# Altium schematic sheet BatteryCharger.SchDoc: WearTech_PMU_Part2
size A4; DrawnBy: WearTech; Revision: 1; SheetNumber: 2; SheetTotal: 4
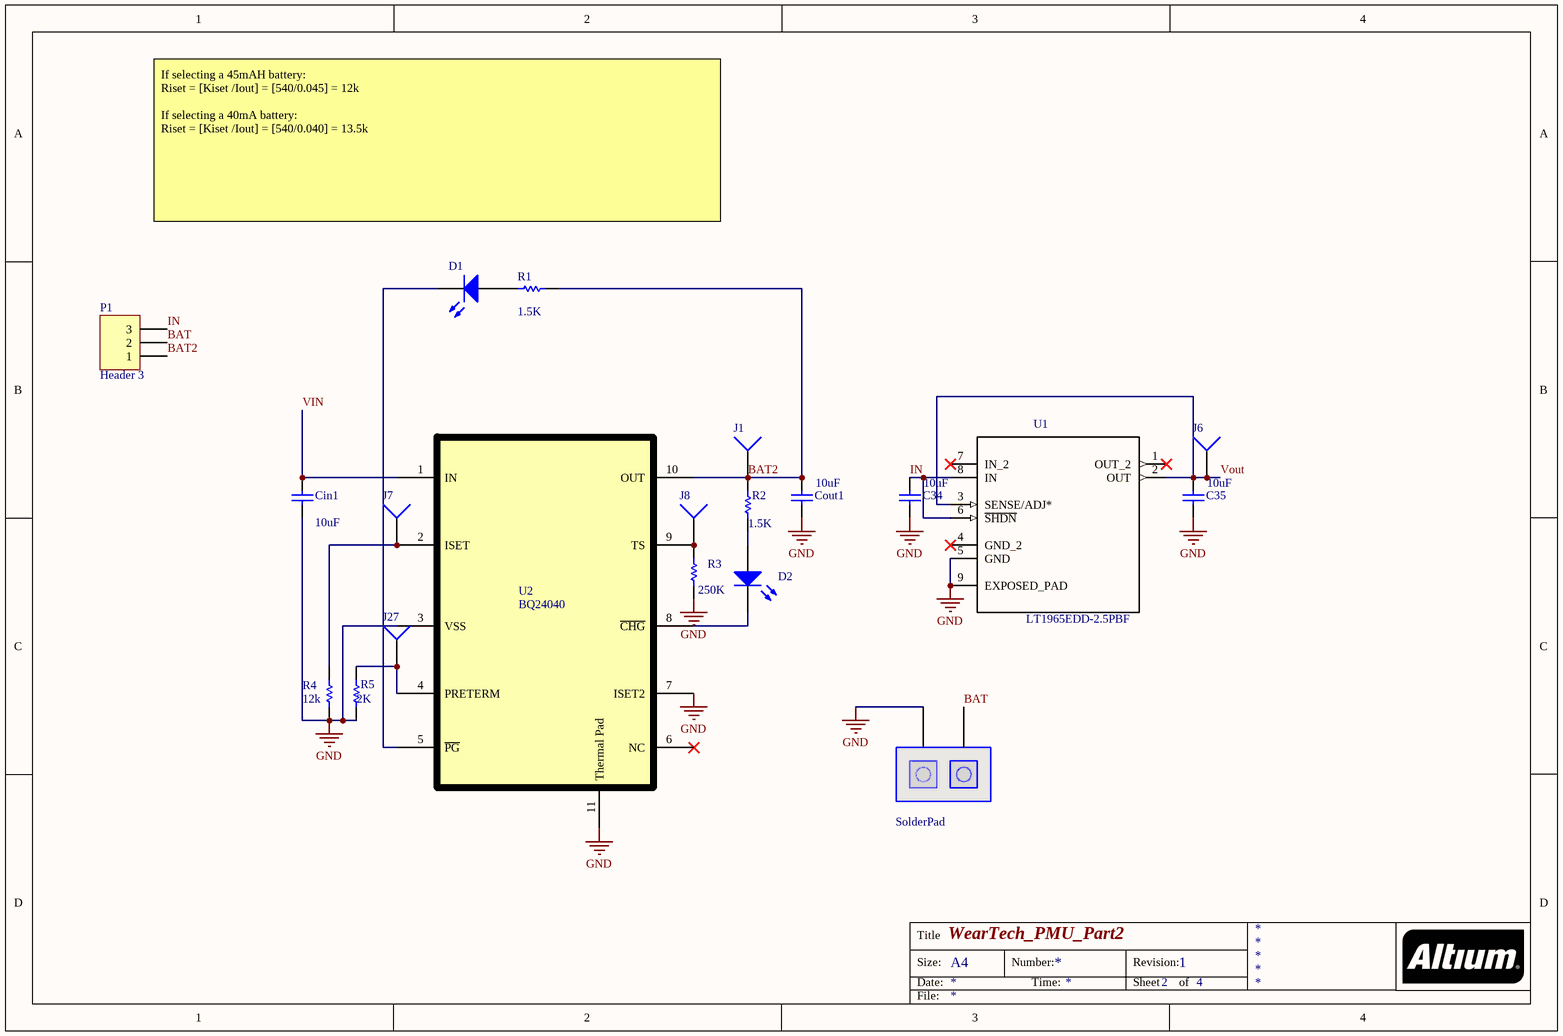
[diagram p0: BatteryCharger.SchDoc]

## Parts
1  SolderPad  [bATTERY_CONNECTION]
C34  value 10uF  [1608[0603]]  (hidden comment: Cap)
C35  value 10uF  [1608[0603]]  (hidden comment: Cap)
Cin1  value 10uF  [1608[0603]]  (hidden comment: Cap)
Cout1  value 10uF  [1608[0603]]  (hidden comment: Cap)
D1  LED0  [1608[0603]]  (value not drawn)
D2  LED0  [1608[0603]]  (value not drawn)
J1  Socket  [PIN1]  (value not drawn)
J6  Socket  [PIN1]  (value not drawn)
J7  Socket  [PIN1]  (value not drawn)
J8  Socket  [PIN1]  (value not drawn)
J27  Socket  [PIN1]  (value not drawn)
P1  Header 3  [HDR1X3]
R1  value 1.5K  [1608[0603]]  (hidden comment: Res1)
R2  value 1.5K  [1608[0603]]  (hidden comment: Res1)
R3  value 250K  [1608[0603]]  (hidden comment: Res1)
R4  value 12k  [1608[0603]]  (hidden comment: Res1)
R5  value 2K  [1608[0603]]  (hidden comment: Res1)
U1  LT1965EDD-2.5PBF  [LT1965]
U2  BQ24040  [BQ24040]

## Nets
GND: 1.2(GND) C34.2 C35.2 Cin1.2 Cout1.2 R3.1 R4.2 R5.2 U1.5(GND) U1.9(EXPOSED_PAD) U2.3(VSS) U2.7(ISET2) U2.11(Thermal_Pad)
BAT: 1.1(BAT) P1.2
BAT2: Cout1.1 J1.1 P1.1 R1.2 R2.1 U2.10(OUT)
IN: C34.1 P1.3 U1.6(~{SHDN}) U1.8(IN)
VIN: Cin1.1 U2.1(IN)
Vout: C35.1 J6.1 U1.2(OUT) U1.3(SENSE/ADJ*)
NetD1_1: D1.1(A) R1.1
NetD1_2: D1.2(K) U2.5(~{PG})
NetD2_1: D2.1(A) R2.2
NetD2_2: D2.2(K) U2.8(~{CHG})
NetJ7_1: J7.1 R4.1 U2.2(ISET)
NetJ8_1: J8.1 R3.2 U2.9(TS)
NetJ27_1: J27.1 R5.1 U2.4(PRETERM)

Not connected (* = marked no-connect by the designer): U1 1(OUT_2)* 4(GND_2)* 7(IN_2)*; U2 6(NC)*

## Notes on the sheet
- If selecting a 45mAH battery:
  Riset = [Kiset /Iout] = [540/0.045] = 12k
  If selecting a 40mA battery:
  Riset = [Kiset /Iout] = [540/0.040] = 13.5k
- Title
- Size:
- Date:
- A4
- Number:
- Time:
- Revision:
- Sheet
- of
- File:

## Library data of the parts
1 = SolderPad: Manufacturer: b; Link: Link; Description: Description; Manufacture Part Num: Manufacture Part Num; DigiKey Part Number: D; ComponentLink1URL: Datasheet; ComponentLink1Description: c
C34 Cout1 = Cap: Capacitor; Manufacture Part Num: 06034D106MAT2A; Manufacturer: AVX Corporation; Description: CAP CER 10UF 4V X5R 0603; Link: https://www.digikey.com/product-detail/en/avx-corporation/06034D106MAT2A/478-5718-1-ND/2136326; DigiKey Part Number: 478-5718-1-ND; ComponentLink1URL: Datasheet; ComponentLink1Description: http://datasheets.avx.com/cx5r.pdf
C35 = Cap: Capacitor; Manufacture Part Num: 06034D106MAT2A; Manufacturer: Murata Electronics North America; Description: CAP CER 10UF 4V X5R 0603; Link: https://www.digikey.com/product-detail/en/avx-corporation/06034D106MAT2A/478-5718-1-ND/2136326; DigiKey Part Number: 490-8278-1-ND; ComponentLink1URL: Datasheet; ComponentLink1Description: http://search.murata.co.jp/Ceramy/image/img/A01X/partnumbering_e_01.pdf
Cin1 = Cap: Capacitor; Manufacture Part Num: GRM188R60J106ME47D; Manufacturer: Murata Electronics North America; Description: CAP CER 10UF 6.3V X5R 0603; Link: https://www.digikey.com/product-detail/en/murata-electronics-north-america/GRM188R60J106ME47D/490-3896-1-ND/965938; DigiKey Part Number: 490-3896-1-ND; ComponentLink1URL: Datasheet; ComponentLink1Description: http://search.murata.co.jp/Ceramy/image/img/A01X/G101/ENG/GRM188R60J106ME47-01.pdf
D1 D2 = LED0: Typical INFRARED GaAs LED; Manufacture Part Num: LO L29K-H2K1-24-Z; Manufacturer: OSRAM Opto Semiconductors Inc.; Description: LED ORANGE DIFFUSED 0603 SMD; Link: https://www.digikey.com/product-detail/en/osram-opto-semiconductors-inc/LO-L29K-H2K1-24-Z/475-2740-1-ND/1938907; ComponentLink1URL: Datasheet; ComponentLink1Description: http://www.osram-os.com/Graphics/XPic0/00077105_0.pdf
  D1: DigiKey Part Number: 475-2740-1-ND
  D2: DigiKey Part Number: 475475-2740-1-ND
J1 J6-J8 J27 = Socket: Manufacture Part Num: 68000-200HLF; Manufacturer: Amphenol FCI; Link: https://www.digikey.com/product-detail/en/amphenol-fci/68000-200HLF/609-5099-1-ND/5968545; Description: Description; DigiKey Part Number: 609-5099-1-ND; ComponentLink1URL: Datasheet; ComponentLink1Description: http://cdn.amphenol-icc.com/media/wysiwyg/files/drawing/68000.pdf
P1 = Header 3: Header, 3-Pin; Manufacturer: Wurth Electronics Inc.; Description: CONN HEADER 3 POS 2.54; Link: https://www.digikey.com/product-detail/en/wurth-electronics-inc/61300311121/732-5316-ND/4846825; Manufacture Part Num: Manufacture Part Num; DigiKey Part Number: 732-5316-ND; ComponentLink1URL: Datasheet; ComponentLink1Description: http://katalog.we-online.de/em/datasheet/6130xx11121.pdf
R1 R2 = Res1: Resistor; Manufacture Part Num: RC0603JR-071K5L; Manufacturer: Yageo; Description: RES SMD 1.5K OHM 5% 1/10W 0603; Link: https://www.digikey.com/product-detail/en/yageo/RC0603JR-071K5L/311-1.5KGRCT-ND/729636; DigiKey Part Number: 311-1.5KGRCT-ND; ComponentLink1URL: Datasheet; ComponentLink1Description: http://www.yageo.com.tw/exep/pages/download/literatures/PYu-R_INT-thick_7.pdf
R3 = Res1: Resistor; Manufacture Part Num: RC0402JR-0710KL; Manufacturer: Yageo; Description: RES SMD 10K OHM 5% 1/16W 0402; Link: https://www.digikey.com/product-detail/en/yageo/RC0402JR-0710KL/311-10KJRTR-ND/726418; DigiKey Part Number: 311-12KGRCT-ND; ComponentLink1URL: Datasheet; ComponentLink1Description: http://www.yageo.com/documents/recent/PYu-RC_Group_51_RoHS_L_8.pdf
R4 = Res1: Resistor; Manufacture Part Num: RC0603JR-0712KL; Manufacturer: Yageo; Description: RES SMD 12K OHM 5% 1/10W 0603; Link: https://www.digikey.com/product-detail/en/yageo/RC0603JR-0712KL/311-12KGRCT-ND/729656; DigiKey Part Number: 311-12KGRCT-ND; ComponentLink1URL: Datasheet; ComponentLink1Description: http://www.yageo.com/documents/recent/PYu-RC_Group_51_RoHS_L_8.pdf
R5 = Res1: Resistor; Manufacture Part Num: ERJ-3EKF2001V; Manufacturer: Panasonic Electronic Components; Description: RES SMD 2K OHM 1% 1/10W 0603; Link: https://www.digikey.com/product-detail/en/panasonic-electronic-components/ERJ-3EKF2001V/P2.00KHCT-ND/198219; DigiKey Part Number: P2.00KHCT-ND; ComponentLink1URL: Datasheet; ComponentLink1Description: https://industrial.panasonic.com/cdbs/www-data/pdf/RDA0000/AOA0000C304.pdf
U1 = LT1965EDD-2.5PBF: PMIC - LDO voltage regulator Linear Technology LT1965EDD-2.5#PBF Positive, fixed DFN 8 (3x3); Manufacture Part Num: LT1965IDD-2.5#PBF; Description: IC REG LINEAR 2.5V 1.1A 8DFN; Value: *; Link: https://www.digikey.com/product-detail/en/linear-technology/LT1965IDD-2.5-PBF/LT1965IDD-2.5-PBF-ND/2107616; DigiKey Part Number: LT1965IDD-2.5#PBF-ND; ComponentLink1URL: Datasheet; ComponentLink1Description: http://www.linear.com/docs/25320; Manufacturer: Linear Technology
U2 = BQ24040: Manufacture Part Num: BQ24040DSQT; Manufacturer: Texas Instruments; Description: IC BATT CHG LI-ION 1 CELL 10SON; Link: https://www.digikey.com/products/en/integrated-circuits-ics/pmic-battery-chargers/781?k=BQ24040DSQT&k=&pkeyword=BQ24040DSQT&pv7=2&mnonly=0&ColumnSort=0&page=1&stock=1&quantity=0&ptm=0&fid=0&pageSize=25; DigiKey Part Number: 296-25136-1-ND; ComponentLink1URL: Datasheet; ComponentLink1Description: http://www.ti.com/lit/ds/symlink/bq24040.pdf